# Altium project BrewController.PrjPcb (part 1 of 2)
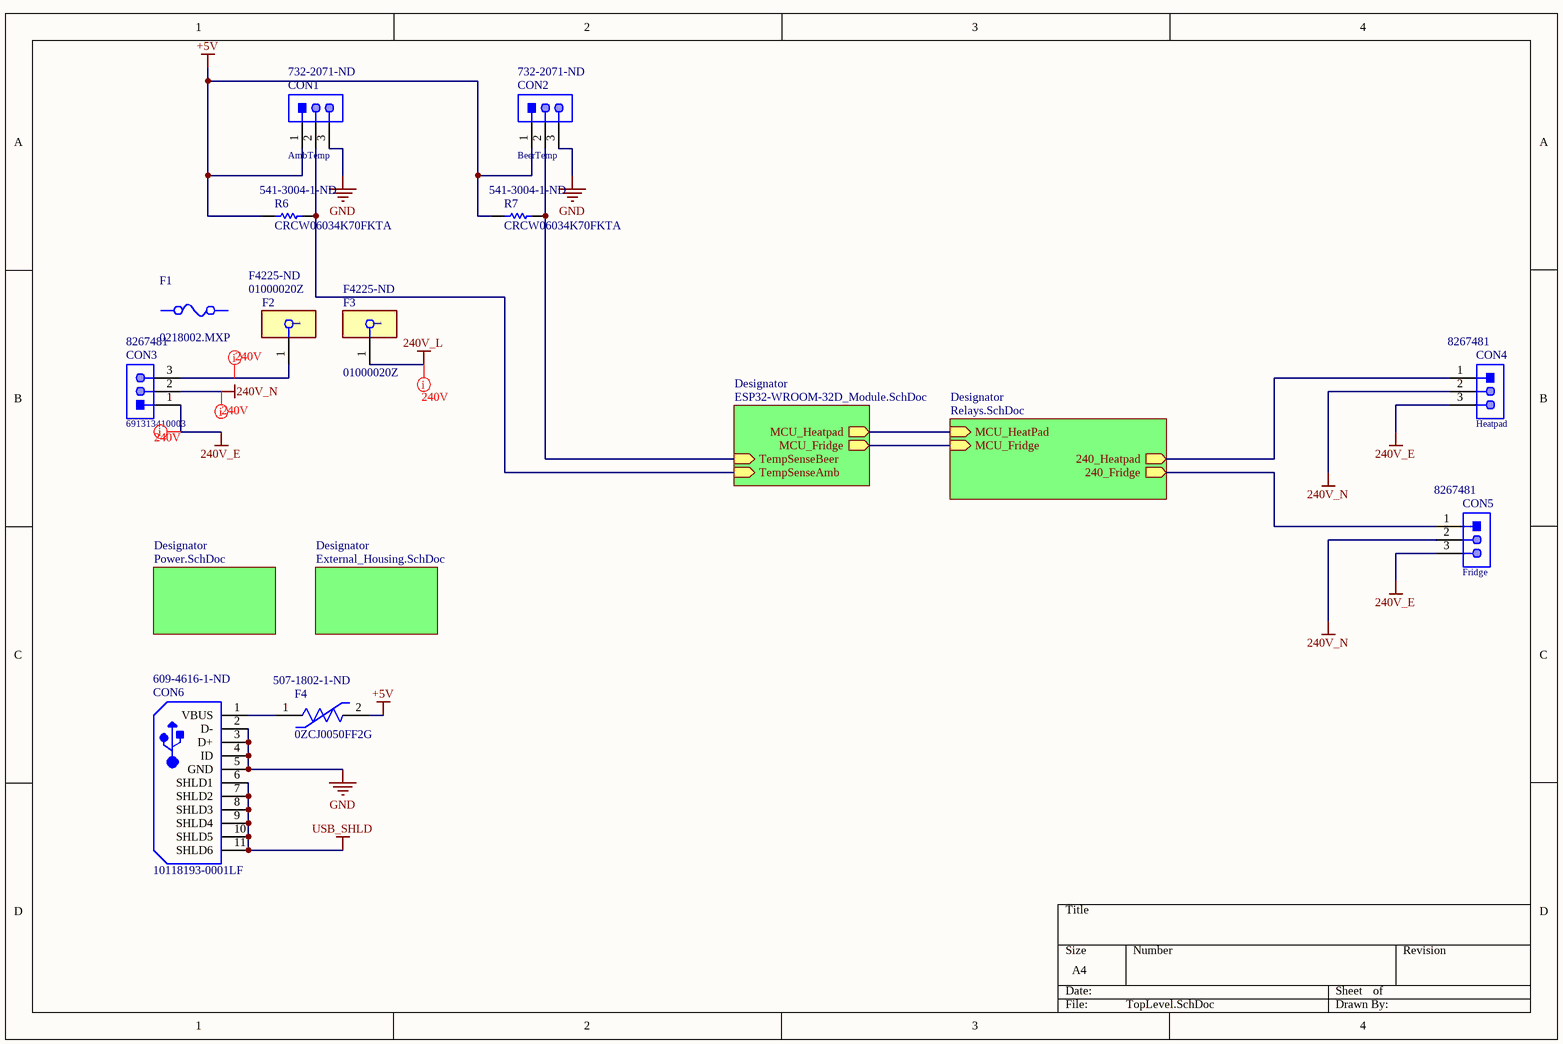
[diagram p0: TopLevel.SchDoc]
PCBRevision: 1; PCBNumber: BrewController
5 sheets, 57 parts. Net scope: hierarchical (ports join the sheet entries above them; power ports are global).
Board file: BrewController.PcbDoc
Sheets:
  TopLevel.SchDoc
    Designator = Relays.SchDoc
    Designator = ESP32-WROOM-32D_Module.SchDoc
    Designator = Power.SchDoc
    Designator = External_Housing.SchDoc

## Sheet TopLevel.SchDoc
size A4

### Parts
CON1  AmbTemp  Supplier Part Number 1: 732-2071-ND  [691313510003]
CON2  BeerTemp  Supplier Part Number 1: 732-2071-ND  [691313510003]
CON3  691313410003  Supplier Part Number 1: 8267481  [691313410003]
CON4  Heatpad  Supplier Part Number 1: 8267481  [691313410003]
CON5  Fridge  Supplier Part Number 1: 8267481  [691313410003]
CON6  10118193-0001LF  Supplier Part Number 1: 609-4616-1-ND  [FCI-10118193-0001LF-5_V]
F1  0218002.MXP  [FP-0218002_MXP-MFG]
F2  01000020Z  Supplier Part Number 1: F4225-ND  [FP-0100-MFG]
F3  01000020Z  Supplier Part Number 1: F4225-ND  [FP-0100-MFG]
F4  0ZCJ0050FF2G  Supplier Part Number 1: 507-1802-1-ND  [FP-0ZCJ0050FF2G-MFG]
R6  CRCW06034K70FKTA  Supplier Part Number 1: 541-3004-1-ND  [RESC1609X50X30NL10T20]
R7  CRCW06034K70FKTA  Supplier Part Number 1: 541-3004-1-ND  [RESC1609X50X30NL10T20]

### Sub-sheets
Designator = Relays.SchDoc: MCU_HeatPad (in), MCU_Fridge (in), 240_Heatpad (out), 240_Fridge (out)
Designator = ESP32-WROOM-32D_Module.SchDoc: MCU_Fridge (out), MCU_Heatpad (out), TempSenseAmb (in), TempSenseBeer (in)
Designator = Power.SchDoc: no entries
Designator = External_Housing.SchDoc: no entries

### Nets
240V_E: CON3.1 CON4.3 CON5.3
240V_L: F3.1
240V_N: CON3.2 CON4.2 CON5.2
+5V: CON1.1 CON2.1 F4.2 R6.1 R7.1
GND: CON1.3 CON2.3 CON6.2(D-) CON6.3(D+) CON6.4(ID) CON6.5(GND)
USB_SHLD: CON6.6(SHLD1) CON6.7(SHLD2) CON6.8(SHLD3) CON6.9(SHLD4) CON6.10(SHLD5) CON6.11(SHLD6)
NetCON1_2: CON1.2 R6.2 ; sheet Designator/TempSenseAmb
NetCON2_2: CON2.2 R7.2 ; sheet Designator/TempSenseBeer
NetCON3_3: CON3.3 F2.1
NetCON4_1: CON4.1 ; sheet Designator/240_Heatpad
NetCON5_1: CON5.1 ; sheet Designator/240_Fridge
NetCON6_1: CON6.1(VBUS) F4.1
NetQ1_1: sheet Designator/MCU_HeatPad, sheet Designator/MCU_Heatpad
NetQ2_1: sheet Designator/MCU_Fridge, sheet Designator/MCU_Fridge

### Layout directives
net class 240V: 240V_E, 240V_L, 240V_N, NetCON3_3

### Library data of the parts
CON1 CON2 = CMP-1502-02193-1: Serie 313 - 5.08mm Close Horizontal PCB Header WR-TBL, 3 pin; Manufacturer: Wurth Elektronik; Pin Number: 3; Gender: Male; Number of Levels: 1; Current: 20A; Voltage: 300V; Pitch: 5.08mm; Manufacturer URL: http://www.we-online.de; Mounting Technology: THT; Publisher: WurthElektronik; Datasheet URL: http://katalog.we-online.de/em/datasheet/6913135100xx.pdf; Part Number: 691313510003; Package Reference: 691313510003; Operating Temperature: -40to105degC; Packaging: Box; Supplier 1: Digi-Key; Manufacturer Part Number: 691313510003; RoHS: Yes; Category: Terminal Blocks; Stock 1: 820; Mount: Through Hole; Contact Plating: Tin; Contact Material: Brass; Color: Green; Number of Rows: 1; Package Quantity: 450; Number of Positions Per Level: 3; Termination: Solder; Number of Contacts: 3; Length: 11.5mm; Height: 12mm; Width: 17.24mm; REACH SVHC: Unknown; ComponentLink1URL: http://www.produktinfo.conrad.com/datenblaetter/1000000-1099999/001088686-da-01-en-WR_TBL_TERMINAL_BLOCK313_691313510003.pdf?src-supplier=Conrad; ComponentLink1Description: http://www.produktinfo.conrad.com/datenblaetter/1000000-1099999/001088686-da-01-en-WR_TBL_TERMINAL_BLOCK313_691313510003.pdf?src-supplier=Conrad; ComponentLink2URL: https://www.distrelec.bizhttp://katalog.we-online.de/em/datasheet/6913135100xx.pdf?mime=application%2Fpdf&src-supplier=Distrelec; ComponentLink2Description: https://www.distrelec.bizhttp://katalog.we-online.de/em/datasheet/6913135100xx.pdf?mime=application%2Fpdf&src-supplier=Distrelec; ComponentLink3URL: http://www.farnell.com/datasheets/1442232.pdf?src-supplier=Element14; ComponentLink3Description: http://www.farnell.com/datasheets/1442232.pdf?src-supplier=Element14; ComponentLink4URL: http://katalog.we-online.de/kataloge/eican/media/pdf/6913135100xx.pdf?src-supplier=Newark; ComponentLink4Description: http://katalog.we-online.de/kataloge/eican/media/pdf/6913135100xx.pdf?src-supplier=Newark; ComponentLink5URL: https://katalog.we-online.de/em/datasheet/6913135100xx.pdf?src-supplier=Digi-Key; ComponentLink5Description: https://katalog.we-online.de/em/datasheet/6913135100xx.pdf?src-supplier=Digi-Key; ComponentLink6URL: http://katalog.we-online.de/kataloge/eican/media/pdf/6913135100xx.pdf?src-supplier=Farnell; ComponentLink6Description: http://katalog.we-online.de/kataloge/eican/media/pdf/6913135100xx.pdf?src-supplier=Farnell
CON3-CON5 = CMP-1502-02425-1: Serie 3134 - 7.62mm Close Horizontal PCB Header WR-TBL, 3 pin; Manufacturer: Wurth Elektronik; Gender: Male; Pin Number: 3; Number of Levels: 1; Current: 20A; Voltage: 300V; Operating Temperature: -40to105degC; Package Reference: 691313410003; Packaging: Box; Mounting Technology: THT; Publisher: WurthElektronik; Part Number: 691313410003; Datasheet URL: http://katalog.we-online.de/em/datasheet/6913134100xx.pdf; Pitch: 7.62mm; Manufacturer URL: http://www.we-online.de; Supplier 1: RSComponents; Manufacturer Part Number: 691313410003; RoHS: Yes; Category: Terminal Blocks; Stock 1: 119; Pricing 1: 1=1.28000 (AUD); Mount: Through Hole; Contact Material: Brass; Color: Green; Number of Rows: 1; Package Quantity: 300; Number of Positions Per Level: 3; Termination: Solder; Number of Contacts: 3; Length: 12.5mm; Height: 12mm; Width: 22.86mm; REACH SVHC: Unknown; ComponentLink1URL: https://datasheet.ciiva.com/795/6913134100xx-795899.pdf?src-supplier=Digi-Key; ComponentLink1Description: https://datasheet.ciiva.com/795/6913134100xx-795899.pdf?src-supplier=Digi-Key; ComponentLink2URL: https://datasheet.ciiva.com/8043/1442230-8043548.pdf?src-supplier=Element14; ComponentLink2Description: https://datasheet.ciiva.com/8043/1442230-8043548.pdf?src-supplier=Element14; ComponentLink3URL: https://datasheet.ciiva.com/48692/001088680-da-01-en-wr-tbl-terminal-block3134-691313410003-48692890.pdf?src-supplier=Conrad; ComponentLink3Description: https://datasheet.ciiva.com/48692/001088680-da-01-en-wr-tbl-terminal-block3134-691313410003-48692890.pdf?src-supplier=Conrad
CON6 = CMP-2000-05119-1: Micro USB B Type Receptacle, -55 to 85 degC, 5-Pin SMD, RoHS, Tape and Reel; Manufacturer: FCI; Insulation Resistance: 1000MOhms; Gender: Female; Current Rating: 1.8A; Number of Contacts: 5Contact; Connector Type: MicroUSBTypeBreceptacle; Mounting Angle: Right; Number of Ports: 1; Max Voltage Rating (AC): 100V; Pitch: 0.65mm; Datasheet Version: Rev. C, 05/2015; Packaging: Reel; Product Category: USBConnectors; Standard: USB2.0; Factory Pack Quantity: 1200; Operating Temperature Range: -55Cto+85C; Termination Style: SMD/SMT; Datasheet URL: http://datasheet.octopart.com/10118193-0001LF-FCI-datasheet-55953155.pdf; Contact Material: CopperAlloy; RoHS: Details; Contact Plating: Gold; Flammability Rating: UL94V-0; Manufacturer URL: http://www.fci.com/; Brand: FCI; Product: MicroUSBTypeBConnectors; Color: Black; Supplier 1: Digi-Key; Manufacturer Part Number: 10118193-0001LF; Category: USB Connectors; Stock 1: 49167; Mount: Surface Mount,Horizontal; Number of Terminals: 5; Housing Material: Polymer; Min Operating Temperature: -55°C; Max Operating Temperature: 85°C; Termination: Solder; Orientation: Right Angle; Package Quantity: 1200; Voltage Rating: 100V; Features: Shielded; Length: 7.86mm; Depth: 5.67mm; Radiation Hardening: No; ComponentLink1URL: https://datasheet.ciiva.com/851/10118193-851106.pdf?src-supplier=Digi-Key; ComponentLink1Description: https://datasheet.ciiva.com/851/10118193-851106.pdf?src-supplier=Digi-Key; ComponentLink2URL: https://datasheet.ciiva.com/4598/10118193ac-197151-4598799.pdf?src-supplier=Mouser; ComponentLink2Description: https://datasheet.ciiva.com/4598/10118193ac-197151-4598799.pdf?src-supplier=Mouser; ComponentLink3URL: https://datasheet.ciiva.com/26853/getdatasheetpartid-418618-26853893.pdf?src-supplier=Verical; ComponentLink3Description: https://datasheet.ciiva.com/26853/getdatasheetpartid-418618-26853893.pdf?src-supplier=Verical; ComponentLink4URL: https://datasheet.ciiva.com/14802/10118193-0001lf-webpage-14802386.pdf?src-supplier=Arrow+Electronics; ComponentLink4Description: https://datasheet.ciiva.com/14802/10118193-0001lf-webpage-14802386.pdf?src-supplier=Arrow+Electronics; ComponentLink5URL: https://datasheet.ciiva.com/851/10118193-851108.pdf?src-supplier=Digi-Key; ComponentLink5Description: https://datasheet.ciiva.com/851/10118193-851108.pdf?src-supplier=Digi-Key; ComponentLink6URL: https://datasheet.ciiva.com/851/10118193-851107.pdf?src-supplier=Digi-Key; ComponentLink6Description: https://datasheet.ciiva.com/851/10118193-851107.pdf?src-supplier=Digi-Key; ComponentLink7URL: https://datasheet.ciiva.com/14618/70236827-14618887.pdf?src-supplier=Allied+Electronics; ComponentLink7Description: https://datasheet.ciiva.com/14618/70236827-14618887.pdf?src-supplier=Allied+Electronics
F1 = CMP-08605-000057-1: FUSE GLASS 2A 250VAC 5X20MM; Manufacturer: Littelfuse Inc; Value: 0.0293Ω; Fuse I2T: 14.45A2Sec; Fuse Interrupt Ac Current: 35A; Max Fuse Ac Voltage: 250V; Fuse Voltage Drop: 150mV; Fuse Blow Speed: Slow; Fuse Current: 2A; Device Class L1: Circuit Protection; Device Class L2: Fuses; ComponentLink2URL: https://www.littelfuse.com/~/media/electronics/datasheets/fuses/littelfuse_fuse_218_datasheet.pdf.pdf; Lead Free: Yes; Category: Fuse; Automotive: No; Resistance: 0.0293Ω; Height: 5.3mm; RoHS: TRUE; Octopart: https://octopart.com/0218002.mxp-littelfuse-558306; Temperature Range Low: -55°C; ComponentLink2Description: Datasheet; Package: 0; Voltage Rating: 250V; Mouser Description: Cartridge Fuses 250V 2A Time Lag (Slo-Blo); Digikey Description: FUSE GLASS 2A 250VAC 5X20MM; Manufacturer Part Number: 0218002.MXP; Temperature: -55°C to +125°C; Device Class L3: unset; Temperature Range High: +125°C
F2 F3 = CMP-08604-000025-1: FUSE CLIP CARTRIDGE 600V 20A PCB; Manufacturer: Littelfuse; Number of Circuits: 1; Voltage Rating: 250V; Body Material: Bronze; Contact Material: Bronze; Contact Plating: Tin; Depth: 5.9mm; Length: 4.1mm; Mount: PCB; Package Quantity: 1000; Packaging: Bulk; Current Rating: 20A; Voltage: 600V; Termination: PC Pin; Orientation: Horizontal; Supplier 1: Digi-Key; Manufacturer Part Number: 01000020Z; RoHS: Yes; Category: Fuse Holders; Stock 1: 20344; ComponentLink1URL: https://datasheet.ciiva.com/4479/littelfuse-100-445-030-520-fuseclip-195180-4479865.pdf?src-supplier=Mouser; ComponentLink1Description: https://datasheet.ciiva.com/4479/littelfuse-100-445-030-520-fuseclip-195180-4479865.pdf?src-supplier=Mouser
F4 = CMP-16043-000004-1: PTC RESET FUSE 8V 500MA 1206; Manufacturer: Bel; Time to Trip: 0.1s; Max Current Rating: 100A; Trip Current: 1A; Hold Current: 500mA; Packaging: Tape and Reel; Package Quantity: 1; Max Operating Temperature: 85°C; Min Operating Temperature: -40°C; Lead Free: Lead Free; Case/Package: 1206; Case Code (Metric): 3216; Mount: Surface Mount; Case Code (Imperial): 1206; Contact Plating: Tin; Supplier 1: Digi-Key; Manufacturer Part Number: 0ZCJ0050FF2G; RoHS: Yes; Category: PTC Resettable Fuses; Stock 1: 196684; ComponentLink1URL: http://www.farnell.com/datasheets/2571638.pdf?src-supplier=Farnell; ComponentLink1Description: http://www.farnell.com/datasheets/2571638.pdf?src-supplier=Farnell; ComponentLink2URL: https://www.belfuse.com/resources/CircuitProtection/datasheets/0ZCJ%20Nov2016.pdf?src-supplier=Digi-Key; ComponentLink2Description: https://www.belfuse.com/resources/CircuitProtection/datasheets/0ZCJ%20Nov2016.pdf?src-supplier=Digi-Key; ComponentLink3URL: http://belfuse.com/pdfs/0ZCJ.pdf?src-supplier=Avnet; ComponentLink3Description: http://belfuse.com/pdfs/0ZCJ.pdf?src-supplier=Avnet; ComponentLink4URL: http://belfuse.com/pdfs/0ZCJ.pdf?src-supplier=Avnet+Asia; ComponentLink4Description: http://belfuse.com/pdfs/0ZCJ.pdf?src-supplier=Avnet+Asia; ComponentLink5URL: http://www.farnell.com/datasheets/2571638.pdf?src-supplier=Newark; ComponentLink5Description: http://www.farnell.com/datasheets/2571638.pdf?src-supplier=Newark
R6 R7 = CMP-2000-03412-1: 0603 4K7; Manufacturer: Vishay Dale; Resistance: 4.7kR; Power Rating: 100mW; Tolerance: 1%; Voltage Rating: 75V; Temperature Coefficient: 100ppm/°C; Part Number: CRCW06034K70FKTA; Supplier 1: Digi-Key; Manufacturer Part Number: CRCW06034K70FKTA; RoHS: Yes; Category: Chip SMD Resistors; Stock 1: 384; Case/Package: 0603; Weight: 7.1E-05oz; Case Code (Metric): 1608; Case Code (Imperial): 0603; Contact Plating: Tin,Lead; Min Operating Temperature: -55°C; Max Operating Temperature: 155°C; Resistor Type: Thick Film; Package Quantity: 5000; Packaging: Tape and Reel; Number of Terminations: 2; Max Power Dissipation: 100mW; Voltage Rating (DC): 75V; Power Dissipation: 100mW; Features: Automotive AEC-Q200; Length: 1.55mm; Height: 0.02inch; Width: 0.033inch; Depth: 0.85mm; Radiation Hardening: No; Lead Free: Contains Lead; Military Standard: Not; ComponentLink1URL: https://datasheet.ciiva.com/2565/dcrcw-2565426.pdf?src-supplier=Digi-Key; ComponentLink1Description: https://datasheet.ciiva.com/2565/dcrcw-2565426.pdf?src-supplier=Digi-Key; ComponentLink2URL: https://datasheet.ciiva.com/9071/dcrcw-9071351.pdf?src-supplier=Avnet; ComponentLink2Description: https://datasheet.ciiva.com/9071/dcrcw-9071351.pdf?src-supplier=Avnet

## Sheet Relays.SchDoc
size A4
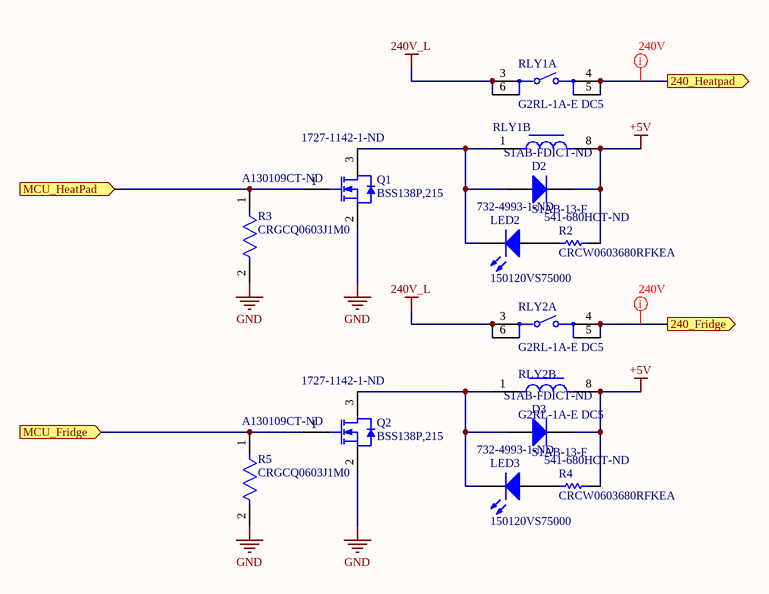
[diagram p1: Relays.SchDoc]

### Parts
(Parts that share a designator on the sheet are numbered #1, #2 ... from top to bottom, then left to right.)
D2  S1AB-13-F  Supplier Part Number 1: S1AB-FDICT-ND  [DIOD-S1AB-13-F-2_V]
D3  S1AB-13-F  Supplier Part Number 1: S1AB-FDICT-ND  [DIOD-S1AB-13-F-2_V]
LED2  150120VS75000  Supplier Part Number 1: 732-4993-1-ND  [1206_A]
LED3  150120VS75000  Supplier Part Number 1: 732-4993-1-ND  [1206_A]
Q1  BSS138P,215  Supplier Part Number 1: 1727-1142-1-ND  [NXP-SOT23_N]
Q2  BSS138P,215  Supplier Part Number 1: 1727-1142-1-ND  [NXP-SOT23_N]
R2  CRCW0603680RFKEA  Supplier Part Number 1: 541-680HCT-ND  [RESC1609X50X30ML10T20]
R3  CRGCQ0603J1M0  Supplier Part Number 1: A130109CT-ND  [FP-CRGCQ0603-IPC_C]
R4  CRCW0603680RFKEA  Supplier Part Number 1: 541-680HCT-ND  [RESC1609X50X30ML10T20]
R5  CRGCQ0603J1M0  Supplier Part Number 1: A130109CT-ND  [FP-CRGCQ0603-IPC_C]
RLY1#1  G2RL-1A-E DC5  [FP-G2RL-1A-E_DC12-MFG]  (part A of 2)
RLY1#2  G2RL-1A-E DC12  [FP-G2RL-1A-E_DC12-MFG]  (value not drawn)  (part B of 2)
RLY2  G2RL-1A-E DC5  [FP-G2RL-1A-E_DC12-MFG]  (parts A,B of 2)

### Ports
240_Fridge (out), 240_Heatpad (out), MCU_Fridge (in), MCU_HeatPad (in)

### Nets
240V_L: RLY1#1.3 RLY1#1.6 RLY2.3 RLY2.6
+5V: D2.1(K) D3.1(K) R2.2 R4.2 RLY1#2.8 RLY2.8
GND: Q1.2(S) Q2.2(S) R3.2 R5.2
NetCON4_1: RLY1#1.4 RLY1#1.5 ; port 240_Heatpad
NetCON5_1: RLY2.4 RLY2.5 ; port 240_Fridge
NetD2_2: D2.2(A) LED2.1(K) Q1.3(D) RLY1#2.1
NetD3_2: D3.2(A) LED3.1(K) Q2.3(D) RLY2.1
NetLED2_2: LED2.2(A) R2.1
NetLED3_2: LED3.2(A) R4.1
NetQ1_1: Q1.1(G) R3.1 ; port MCU_HeatPad
NetQ2_1: Q2.1(G) R5.1 ; port MCU_Fridge

### Layout directives
net class 240V: NetCON4_1, NetCON5_1

### Library data of the parts
D2 D3 = CMP-0586-00001-2: 1.0 A Surface Mount Glass Passivated Rectifier, SMB, -65 to 150 degC, Tape and Reel; Manufacturer: Diodes Inc; Reverse Recovery Time (Type): 1.8 us; Typical Thermal Resistance, Junction to Terminal: 30 degC/W; Forward Voltage (Max): 1.1 V; Typical Total Capacitance (Type): 10 pF; Forward Current: 1A; Reverse Recovery Time: 1.8us; Max Repetitive Reverse Voltage (Vrrm): 50V; Peak Non-Repetitive Surge Current: 30A; Element Configuration: Single; Max Reverse Current: 5uA; Forward Voltage: 1.1V; Polarity: Standard; Capacitance: 10pF; PackageDescription: 2-Pin SMD, Body 3.62 x 4.315 mm; Mounting Technology: Surface Mount; ComponentLink2URL: http://www.diodes.com/datasheets/ds16003.pdf; DatasheetVersion: Rev. 22-2; PackageReference: S1AB-13-F; ComponentLink3URL: http://www.diodes.com/datasheets/ds16003.pdf; ComponentLink3Description: Package Specification; RoHS Compliance: TRUE; Packing: Tape and Reel; ComponentLink1Description: Manufacturer URL; ComponentLink2Description: Datasheet; Operating and Storage Temperature Range: -65 to 150 degC; ComponentLink1URL: http://www.diodes.com/; PartNumber: S1AB-13-F; Supplier 1: Digi-Key; Manufacturer Part Number: S1AB-13-F; RoHS: Yes; Category: Rectifier Diodes; Stock 1: 46580; Case/Package: SMB; Number of Pins: 2; Weight: 0.00328oz; Min Operating Temperature: -65°C; Max Operating Temperature: 150°C; Package Quantity: 3000; Max Surge Current: 30A; Recovery Time: 1.8us; Packaging: Tape and Reel; Reverse Voltage (DC): 50V; Average Rectified Current: 1A; Voltage Rating (DC): 50V; Current Rating: 1A; Output Current: 1A; Max Reverse Voltage (DC): 50V; Termination: SMD/SMT; Length: 4.57mm; Height: 2.42mm; Width: 3.94mm; Radiation Hardening: No; Lead Free: Lead Free; ComponentLink4URL: https://datasheet.ciiva.com/8303/ds16003-8303190.pdf?src-supplier=Avnet; ComponentLink4Description: https://datasheet.ciiva.com/8303/ds16003-8303190.pdf?src-supplier=Avnet; ComponentLink5URL: https://datasheet.ciiva.com/16200/ds16003-16200248.pdf?src-supplier=Future+Electronics; ComponentLink5Description: https://datasheet.ciiva.com/16200/ds16003-16200248.pdf?src-supplier=Future+Electronics
LED2 LED3 = CMP-1426-00016-1: SMD mono-color Chip LED, WL-SMCW, Bright Green; Manufacturer: Wuerth Elektronik; Luminous Intensity: 40mcd; Forward Current: 30mA; Forward Voltage: 2V; Viewing Angle: 140°; Lens Style: Clear,Rectangular; Wavelength: 570nm; Test Current: 20mA; ComponentLink2URL: http://katalog.we-online.com/led/datasheet/150120VS75000.pdf; PartNumber: 150120VS75000; Color: Bright Green; ComponentLink2Description: Datasheet; ComponentLink1URL: http://www.we-online.com; PackageReference: 1206_A; ComponentLink1Description: Manufacturer URL; Supplier 1: Digi-Key; Manufacturer Part Number: 150120VS75000; RoHS: Yes; Category: LEDs; Stock 1: 4286; Mount: Surface Mount; Case/Package: 1206; Case Code (Metric): 3216; Case Code (Imperial): 1206; Min Operating Temperature: -40°C; Max Operating Temperature: 85°C; Package Quantity: 1; Packaging: Tape and Reel; Dominant Wavelength: 570nm; Length: 3.2mm; Height: 0.68mm; Width: 1.6mm; REACH SVHC: Unknown; ComponentLink3URL: https://datasheet.ciiva.com/29561/150120vs75000-29561865.pdf?src-supplier=Digi-Key; ComponentLink3Description: https://datasheet.ciiva.com/29561/150120vs75000-29561865.pdf?src-supplier=Digi-Key; ComponentLink4URL: https://datasheet.ciiva.com/29279/759444-da-01-en-chipled-1206-w-kl-h-gruen-150120vs7500-29279050.pdf?src-supplier=Conrad; ComponentLink4Description: https://datasheet.ciiva.com/29279/759444-da-01-en-chipled-1206-w-kl-h-gruen-150120vs7500-29279050.pdf?src-supplier=Conrad; ComponentLink5URL: https://datasheet.ciiva.com/29561/150120vs75000-29561866.pdf?src-supplier=Digi-Key; ComponentLink5Description: https://datasheet.ciiva.com/29561/150120vs75000-29561866.pdf?src-supplier=Digi-Key; ComponentLink6URL: https://datasheet.ciiva.com/22656/1911467-22656987.pdf?src-supplier=Element14; ComponentLink6Description: https://datasheet.ciiva.com/22656/1911467-22656987.pdf?src-supplier=Element14; ComponentLink7URL: https://datasheet.ciiva.com/29561/150120vs75000-29561867.pdf?src-supplier=Digi-Key; ComponentLink7Description: https://datasheet.ciiva.com/29561/150120vs75000-29561867.pdf?src-supplier=Digi-Key
Q1 Q2 = CMP-1259-00085-1: N-Channel Trench MOSFET, 60 V, 0.36 A, -55 to 150 degC, 3-Pin SOT23, Tape and Reel; Manufacturer: NXP Semiconductors; IDM [max] (A): 1.2; Channel Type: N; VDS [max] (V): 60; Packing: Tape & Reel; Automotive Qualified: Y; ID [max] (A): 0.36; ComponentLink1URL: http://www.nxp.com/; ComponentLink1Description: Manufacturer URL; Code_JEDEC: TO-236AB; PackageReference: SOT23; PartNumber: BSS138P,215; ComponentLink2URL: http://www.nxp.com/documents/data_sheet/BSS138P.pdf; PackageDescription: 3-Pin Small Outline Transistor Package, Body 2.9 x 1.3 mm, Pitch 0.95 mm; VGSth [typ] (V): 1.2; DatasheetVersion: Rev. 1; Mounting Technology: Surface Mount; ComponentLink3URL: http://www.nxp.com/documents/outline_drawing/sot023_po.pdf; ComponentLink3Description: Package Specification; ComponentLink2Description: Datasheet; PackageVersion: 06-03-16, 03/2006; Supplier 1: Digi-Key; Manufacturer Part Number: BSS138P,215; RoHS: No; Category: MOSFETs; Stock 1: 527110; ComponentLink4URL: http://www.farnell.com/datasheets/923164.pdf?src-supplier=Farnell; ComponentLink4Description: http://www.farnell.com/datasheets/923164.pdf?src-supplier=Farnell; ComponentLink5URL: https://www.mouser.com/ds/2/302/BSS138P-114022.pdf?src-supplier=Mouser; ComponentLink5Description: https://www.mouser.com/ds/2/302/BSS138P-114022.pdf?src-supplier=Mouser; ComponentLink6URL: https://assets.nexperia.com/documents/data-sheet/BSS138P.pdf?src-supplier=Digi-Key; ComponentLink6Description: https://assets.nexperia.com/documents/data-sheet/BSS138P.pdf?src-supplier=Digi-Key; ComponentLink7URL: http://www.farnell.com/datasheets/923164.pdf?src-supplier=Newark; ComponentLink7Description: http://www.farnell.com/datasheets/923164.pdf?src-supplier=Newark
R2 R4 = CMP-2000-03529-1: 0603 680R; Manufacturer: Vishay Dale; Tolerance: 1%; Temperature Coefficient: 100ppm/°C; Power Rating: 100mW; Voltage Rating: 75V; Part Number: CRCW0603680RFKEA; Supplier 1: Digi-Key; Manufacturer Part Number: CRCW0603680RFKEA; RoHS: Yes; Category: Chip SMD Resistors; Stock 1: 53960; Case/Package: 0603; Number of Pins: 2; Weight: 7.1E-05oz; Case Code (Imperial): 0603; Case Code (Metric): 1608; Contact Plating: Tin; Min Operating Temperature: -55°C; Max Operating Temperature: 155°C; Resistance: 680R; Packaging: Tape and Reel; Resistor Type: Thick Film; Number of Terminations: 2; Termination: SMD/SMT; Max Power Dissipation: 100mW; Package Quantity: 10; Voltage Rating (DC): 75V; Features: Automotive AEC-Q200; Working Voltage: 75V; Length: 1.55mm; Height: 0.45mm; Width: 0.85mm; Depth: 0.85mm; Radiation Hardening: No; REACH SVHC: Unknown; Military Standard: Not; Lead Free: Lead Free; ComponentLink1URL: https://datasheet.ciiva.com/11809/0900766b80d98afc-11809697.pdf?src-supplier=RSComponents; ComponentLink1Description: https://datasheet.ciiva.com/11809/0900766b80d98afc-11809697.pdf?src-supplier=RSComponents; ComponentLink2URL: https://datasheet.ciiva.com/16884/dcrcwe3-16884089.pdf?src-supplier=Avnet+Europe; ComponentLink2Description: https://datasheet.ciiva.com/16884/dcrcwe3-16884089.pdf?src-supplier=Avnet+Europe; ComponentLink3URL: https://datasheet.ciiva.com/2465/dcrcwe3-2465995.pdf?src-supplier=Digi-Key; ComponentLink3Description: https://datasheet.ciiva.com/2465/dcrcwe3-2465995.pdf?src-supplier=Digi-Key; ComponentLink4URL: https://datasheet.ciiva.com/7777/1697337-7777339.pdf?src-supplier=Element14; ComponentLink4Description: https://datasheet.ciiva.com/7777/1697337-7777339.pdf?src-supplier=Element14; ComponentLink5URL: https://datasheet.ciiva.com/22870/70201119-22870779.pdf?src-supplier=Allied+Electronics; ComponentLink5Description: https://datasheet.ciiva.com/22870/70201119-22870779.pdf?src-supplier=Allied+Electronics; ComponentLink6URL: https://datasheet.ciiva.com/16762/70201119-16762012.pdf?src-supplier=Allied+Electronics; ComponentLink6Description: https://datasheet.ciiva.com/16762/70201119-16762012.pdf?src-supplier=Allied+Electronics; ComponentLink7URL: https://datasheet.ciiva.com/5540/dcrcwe3-109170-5540887.pdf?src-supplier=Mouser; ComponentLink7Description: https://datasheet.ciiva.com/5540/dcrcwe3-109170-5540887.pdf?src-supplier=Mouser; ComponentLink8URL: https://datasheet.ciiva.com/2465/dcrcwe3-2465993.pdf?src-supplier=Digi-Key; ComponentLink8Description: https://datasheet.ciiva.com/2465/dcrcwe3-2465993.pdf?src-supplier=Digi-Key; ComponentLink9URL: https://datasheet.ciiva.com/2465/dcrcwe3-2465994.pdf?src-supplier=Digi-Key; ComponentLink9Description: https://datasheet.ciiva.com/2465/dcrcwe3-2465994.pdf?src-supplier=Digi-Key; ComponentLink10URL: https://datasheet.ciiva.com/7777/1720486-7777564.pdf?src-supplier=Element14; ComponentLink10Description: https://datasheet.ciiva.com/7777/1720486-7777564.pdf?src-supplier=Element14; ComponentLink11URL: https://datasheet.ciiva.com/16200/dcrcwe3-16200589.pdf?src-supplier=Future+Electronics; ComponentLink11Description: https://datasheet.ciiva.com/16200/dcrcwe3-16200589.pdf?src-supplier=Future+Electronics
R3 R5 = CMP-03211-005148-1: CRGCQ0603 1MΩ 5% ±100ppm/°C 75V; Manufacturer: TE Connectivity; Power Rating: 0.1W; Tolerance: 0.05; Max Power Dissipation: 100mW; Temperature Range High: +155°C; RoHS: TRUE; Value: 1MΩ; Lead Free: Yes; Package: CRGCQ0603; Octopart: https://octopart.com/crgcq0603j1m0-te+connectivity-91018106; Manufacturer Part Number: CRGCQ0603J1M0; Ambient Temperature Range High: +70°C; Ipc Land Pattern Name: RESC16080X45; ComponentLink2Description: Datasheet; ComponentLink2URL: https://www.te.com/commerce/DocumentDelivery/DDEController?Action=showdoc&DocId=Data+Sheet%7F1773204-3%7F1%7Fpdf%7FEnglish%7FENG_DS_1773204-3_1.pdf%7F4-2176339-1379; Device Class L1: Passive Components; Temperature: -55°C to +155°C; Device Class L3: Chip SMD Resistors; Temperature Range Low: -55°C; Composition: Thick Film; Voltage Rating: 75V; Resistance: 1MΩ; Height: 0.55mm; Temperature Coefficient: ±100ppm/°C; Category: Res; Device Class L2: Resistors; Series: CRGCQ; Supplier 1: Digi-Key; Stock 1: 139970; Case/Package: 0603; Case Code (Imperial): 0603; Case Code (Metric): 1608; Min Operating Temperature: -55°C; Max Operating Temperature: 155°C; Resistor Type: Thick Film; Features: Moisture Resistant,Automotive AEC-Q200; Packaging: Tape and Reel; Number of Terminations: 2; ComponentLink1URL: https://4donline.ihs.com/images/VipMasterIC/IC/TYEL/TYEL-S-A0004929575/TYEL-S-A0004929575-1.pdf?hkey=52A5661711E402568146F3353EA87419&src-supplier=Element14; ComponentLink1Description: https://4donline.ihs.com/images/VipMasterIC/IC/TYEL/TYEL-S-A0004929575/TYEL-S-A0004929575-1.pdf?hkey=52A5661711E402568146F3353EA87419&src-supplier=Element14; ComponentLink3URL: https://www.te.com/commerce/DocumentDelivery/DDEController?Action=srchrtrv&amp;DocNm=1773204-3&amp;DocType=DS&amp;DocLang=English&src-supplier=Digi-Key; ComponentLink3Description: https://www.te.com/commerce/DocumentDelivery/DDEController?Action=srchrtrv&amp;DocNm=1773204-3&amp;DocType=DS&amp;DocLang=English&src-supplier=Digi-Key; ComponentLink4URL: https://www.te.com/commerce/DocumentDelivery/DDEController?Action=srchrtrv&DocNm=1773204-3&DocType=DS&DocLang=English&src-supplier=Digi-Key; ComponentLink4Description: https://www.te.com/commerce/DocumentDelivery/DDEController?Action=srchrtrv&DocNm=1773204-3&DocType=DS&DocLang=English&src-supplier=Digi-Key; ComponentLink5URL: https://4donline.ihs.com/images/VipMasterIC/IC/TYEL/TYEL-S-A0004929575/TYEL-S-A0004929575-1.pdf?hkey=52A5661711E402568146F3353EA87419&src-supplier=Farnell; ComponentLink5Description: https://4donline.ihs.com/images/VipMasterIC/IC/TYEL/TYEL-S-A0004929575/TYEL-S-A0004929575-1.pdf?hkey=52A5661711E402568146F3353EA87419&src-supplier=Farnell; ComponentLink6URL: https://4donline.ihs.com/images/VipMasterIC/IC/TYEL/TYEL-S-A0004929575/TYEL-S-A0004929575-1.pdf?hkey=52A5661711E402568146F3353EA87419&src-supplier=Newark; ComponentLink6Description: https://4donline.ihs.com/images/VipMasterIC/IC/TYEL/TYEL-S-A0004929575/TYEL-S-A0004929575-1.pdf?hkey=52A5661711E402568146F3353EA87419&src-supplier=Newark
RLY1#1 RLY2 = CMP-08822-000015-1_5V: RELAY GEN PURPOSE SPST 16A 5V; Manufacturer: Omron; Number Of Contacts: 1; Coil Power: 400mW; Coil Type: Non-Latching; Coil Current: 80mA; Throw Configuration: SPST-NO; Coil Resistance: 62.5Ω; Current Rating: 16A; Ambient Temperature Range Low: -40°C; ComponentLink2URL: https://omronfs.omron.com/en_US/ecb/products/pdf/en-g2rl.pdf; Octopart: https://octopart.com/g2rl-1a-e-dc5-omron-797358; Automotive: No; Device Class L2: Relays; Ambient Temperature Range High: +85°C; Temperature Range Low: -40°C; RoHS: TRUE; ComponentLink2Description: Datasheet; Lead Free: Yes; Device Class L1: Electromechanical; Coil Voltage: 5V; Category: Relay; Manufacturer Part Number: G2RL-1A-E DC5; Temperature: -40°C to +85°C; Digikey Description: RELAY GEN PURPOSE SPST 16A 5V; Height: 15.7mm; Device Class L3: Power Relays; Temperature Range High: +85°C; Package: 0; Switching Current: 16A; Mouser Description: Power Relay 5VDC 16A SPST-NO (( 29mm 12.7mm 15.7mm)) Through Hole
RLY1#2 = CMP-08822-000015-1: RELAY GEN PURPOSE SPST 16A 12V; Manufacturer: Omron; Manufacturer Part Number: G2RL-1A-E DC5; Number Of Contacts: 1; Coil Power: 400mW; Coil Type: Non-Latching; Coil Current: 80mA; Coil Voltage: 5V; Throw Configuration: SPST-NO; Coil Resistance: 62.5Ω; Current Rating: 16A; Ambient Temperature Range Low: -40°C; ComponentLink2URL: https://omronfs.omron.com/en_US/ecb/products/pdf/en-g2rl.pdf; Octopart: https://octopart.com/g2rl-1a-e-dc5-omron-797358; Automotive: No; Device Class L2: Relays; Ambient Temperature Range High: +85°C; Temperature Range Low: -40°C; RoHS: TRUE; ComponentLink2Description: Datasheet; Lead Free: Yes; Device Class L1: Electromechanical; Category: Relay; Temperature: -40°C to +85°C; Digikey Description: RELAY GEN PURPOSE SPST 16A 5V; Height: 15.7mm; Device Class L3: Power Relays; Temperature Range High: +85°C; Package: 0; Switching Current: 16A; Mouser Description: Power Relay 5VDC 16A SPST-NO (( 29mm 12.7mm 15.7mm)) Through Hole